# EAGLE schematic KVL (EAGLE 8.4.0)
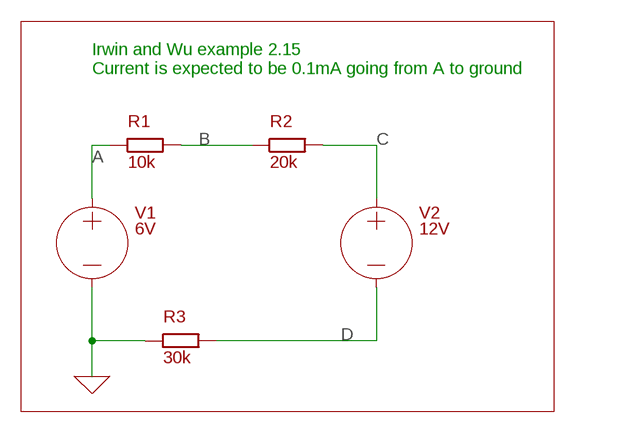
[diagram p0: schematic, sheet 1]

## Parts
R1  10k  R  (no package)
R2  20k  R  (no package)
R3  30k  R  (no package)
V1  6V  VOLTAGE  (no package)
V2  12V  VOLTAGE  (no package)

## Nets
0: R3.1 V1.- ; supply symbol labelled GND
A: R1.1 V1.+
B: R1.2 R2.1
C: R2.2 V2.+
D: R3.2 V2.-

## Notes on the sheet
- Irwin and Wu example 2.15
  Current is expected to be 0.1mA going from A to ground

## Library data of the parts
R1-R3 = ngspice-simulation:R: RESISTOR
V1 V2 = ngspice-simulation:VOLTAGE: Independent Voltage Source, either DC, AC, PULSE, SINE, PWL, EXP, or SFFM; VALUE: 0V